# EAGLE board main_v2 (EAGLE 7.2.0)
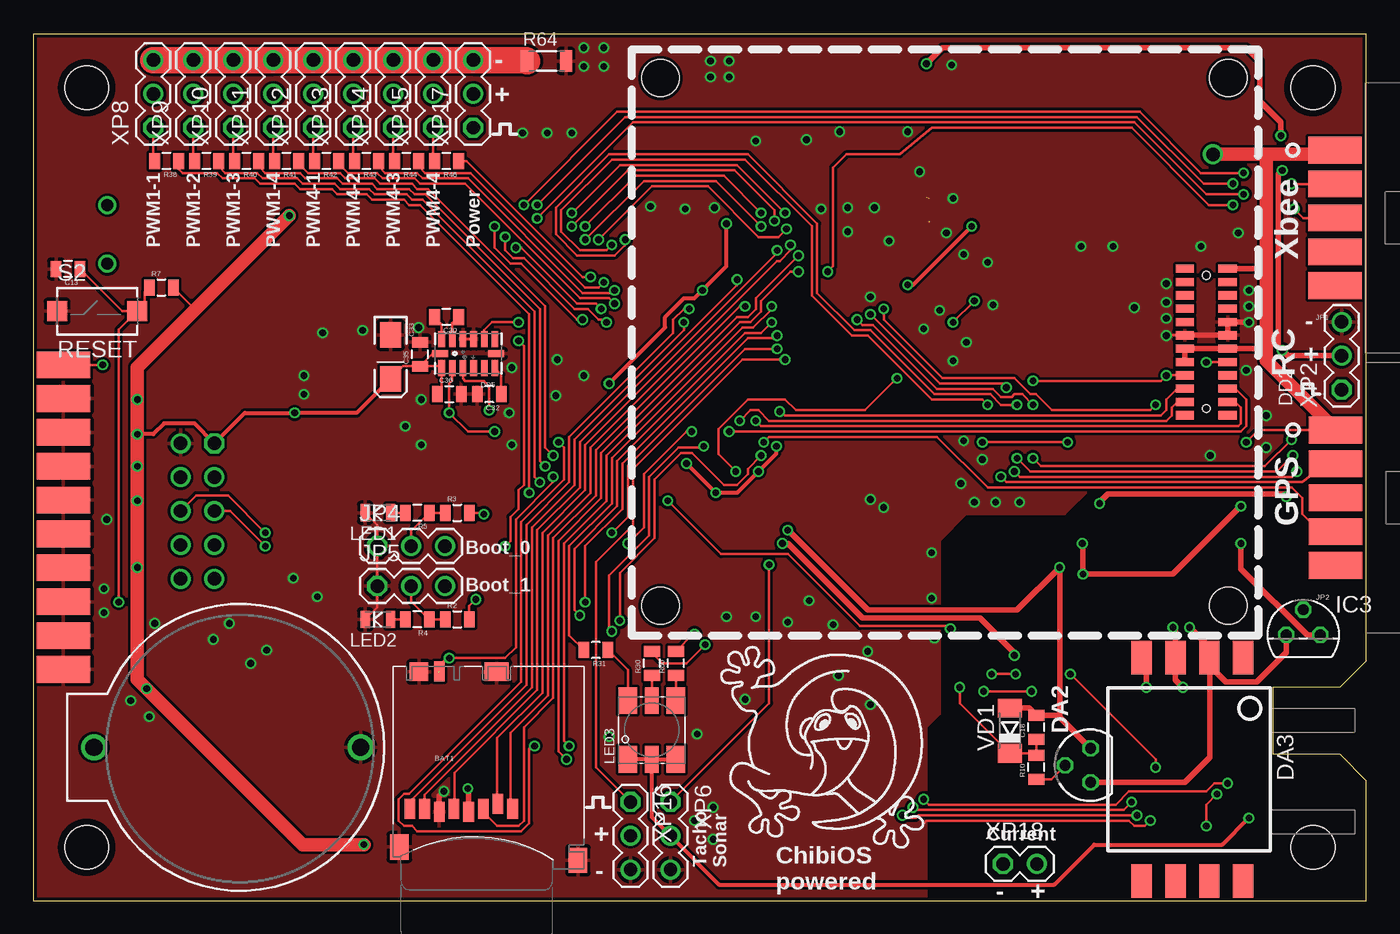
[diagram p3: board, top side]
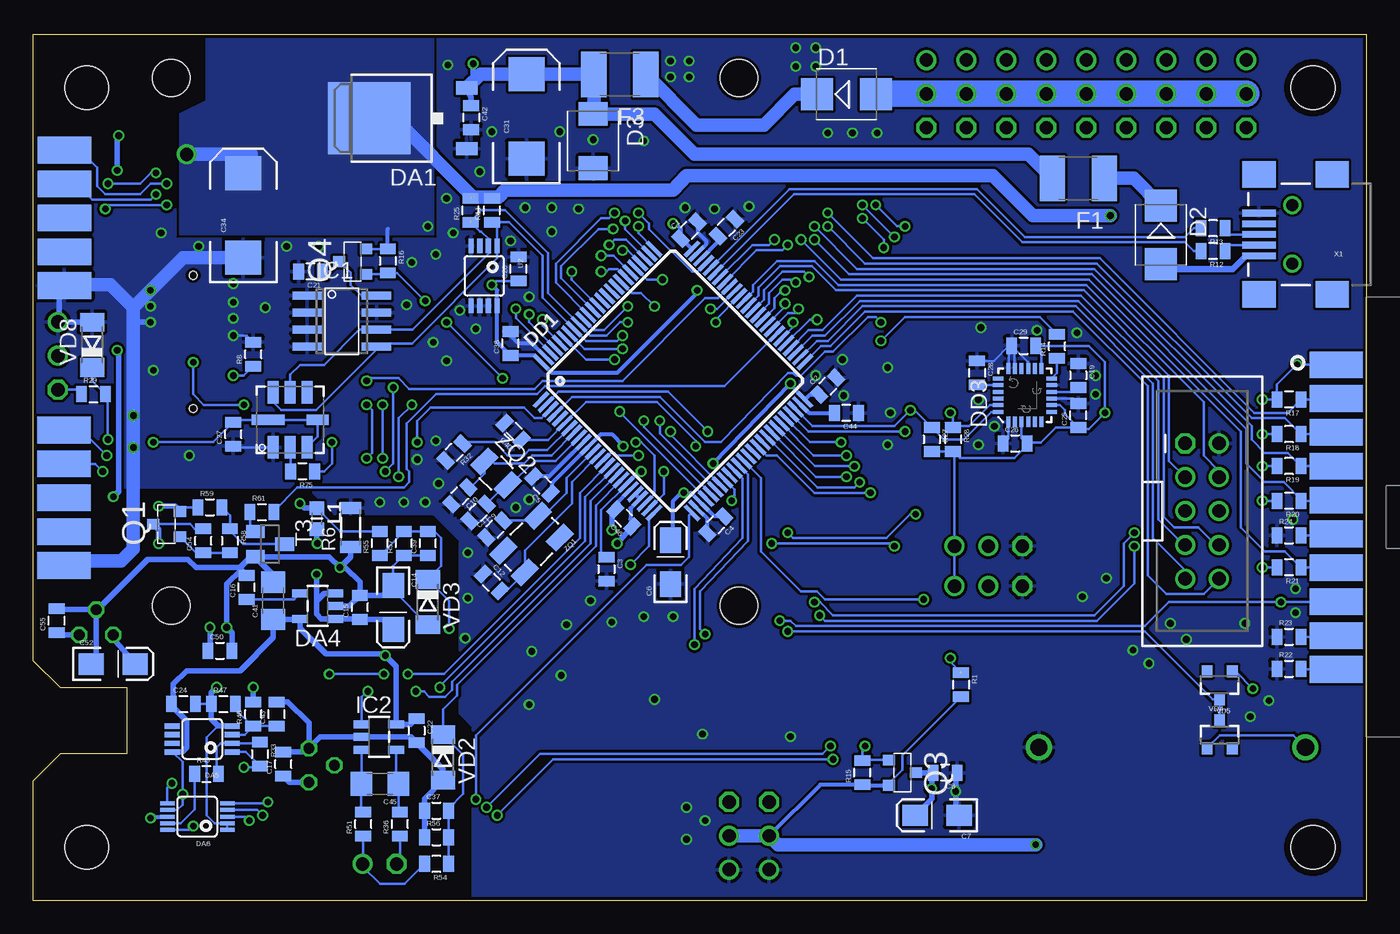
[diagram p4: board, bottom side, seen from below]

Size 100 x 65 mm. Coordinates in mm from the lower left corner, seen from the top.
Outline: 0,0 100,0 100,9 98,11 93,11 93,16 98,16 100,18 100,65 0,65 0,0
Copper layers (1*16): Top 0.035mm / dielectric 1.1mm / Bottom 0.035mm
Design rules "SeeedStudio_DRU_no_angle_20130527": minimum track width 6mil, minimum drill 12mil, track to track 6mil, track to pad 6mil, pad to pad 6mil, via to via 6mil, smd to smd 0mil, copper to edge 10mil, drill to drill 10mil, minimum pad ring 6mil, minimum via ring 6mil, stop-mask expansion 2mil, vias tented up to drill 25mil, thermal gap 10mil
Net classes: 1 +5V_A: width 0.4 mm, drill 0.5 mm; 2 +3.3V_A: width 0.4 mm, drill 0.5 mm; 3 GND_A: width 0.4 mm, drill 0.5 mm
tRestrict: 4 lines
bRestrict: 4 lines

## Footprints (pad centres in the part's own frame; a part is rotated, then mirrored left to right if it is on the bottom)
BATTCOM_20MM_PTH = drill 1.3: 1 20,0; 2 0,0
0805 = smd 0.8 x 1.2: 1 -0.9,0; 2 0.9,0
EIA3216-KIT = smd 1.9 x 1.6: A 1.65,0; C -1.65,0
EIA7343 = smd 2.55 x 2.7: A 3.17,0; C -3.17,0
1206 = smd 1.6 x 1.8: 1 -1.4,0; 2 1.4,0
SMB = smd 2.4 x 2.4: A 2.2,0; C -2.2,0
SMBJ = smd 1.78 x 2.16: A 2.04,0; C -2.03,0
TO252 = smd 1 x 1.6: 1 -2.28,-4.8; 2 2.28,-4.8 | smd 5.4 x 6.2: 3 0,2.5
TO92 = drill 0.813 octagon: 1 -1.27,0; 2 0,1.905; 3 1.27,0
482 = smd 2.54 x 1.524: 1 -7.62,3.81; 2 -7.62,1.27; 3 -7.62,-1.27; 4 -7.62,-3.81; 5 9.144,-3.81; 6 9.144,-1.27; 7 9.144,1.27; 8 9.144,3.81
SOT23-5 = smd 0.6 x 1.2: 1 -0.95,-1.306; 2 0,-1.306; 3 0.95,-1.306; 4 0.95,1.306; 5 -0.95,1.306
MSOP8 = smd 0.4 x 1.1: 1 -0.975,-2.25; 2 -0.325,-2.25; 3 0.325,-2.25; 4 0.975,-2.25; 5 0.975,2.25; 6 0.325,2.25; 7 -0.325,2.25; 8 -0.975,2.25
MSOP10 = smd 0.3 x 1.1: 1 -1,-2.25; 2 -0.5,-2.25; 3 0,-2.25; 4 0.5,-2.25; 5 1,-2.25; 6 1,2.25; 7 0.5,2.25; 8 0,2.25; 9 -0.5,2.25; 10 -1,2.25
TQFP100 = smd 1.5 x 0.3: 1 -8,6; 2 -8,5.5; 3 -8,5; 4 -8,4.5; 5 -8,4; 6 -8,3.5; 7 -8,3; 8 -8,2.5; 9 -8,2; 10 -8,1.5; 11 -8,1; 12 -8,0.5; 13 -8,0; 14 -8,-0.5; 15 -8,-1; 16 -8,-1.5; 17 -8,-2; 18 -8,-2.5; 19 -8,-3; 20 -8,-3.5; 21 -8,-4; 22 -8,-4.5; 23 -8,-5; 24 -8,-5.5; 25 -8,-6; 51 8,-6; 52 8,-5.5; 53 8,-5; 54 8,-4.5; 55 8,-4; 56 8,-3.5; 57 8,-3; 58 8,-2.5; 59 8,-2; 60 8,-1.5; 61 8,-1; 62 8,-0.5; 63 8,0; 64 8,0.5; 65 8,1; 66 8,1.5; 67 8,2; 68 8,2.5; 69 8,3; 70 8,3.5; 71 8,4; 72 8,4.5; 73 8,5; 74 8,5.5; 75 8,6 | smd 0.3 x 1.5: 26 -6,-8; 27 -5.5,-8; 28 -5,-8; 29 -4.5,-8; 30 -4,-8; 31 -3.5,-8; 32 -3,-8; 33 -2.5,-8; 34 -2,-8; 35 -1.5,-8; 36 -1,-8; 37 -0.5,-8; 38 0,-8; 39 0.5,-8; 40 1,-8; 41 1.5,-8; 42 2,-8; 43 2.5,-8; 44 3,-8; 45 3.5,-8; 46 4,-8; 47 4.5,-8; 48 5,-8; 49 5.5,-8; 50 6,-8; 76 6,8; 77 5.5,8; 78 5,8; 79 4.5,8; 80 4,8; 81 3.5,8; 82 3,8; 83 2.5,8; 84 2,8; 85 1.5,8; 86 1,8; 87 0.5,8; 88 0,8; 89 -0.5,8; 90 -1,8; 91 -1.5,8; 92 -2,8; 93 -2.5,8; 94 -3,8; 95 -3.5,8; 96 -4,8; 97 -4.5,8; 98 -5,8; 99 -5.5,8; 100 -6,8
ADIS16480 = smd 0.61 x 1.37: 1 25.3,0.05; 2 25.3,3.25; 3 24.3,0.05; 4 24.3,3.25; 5 23.3,0.05; 6 23.3,3.25; 7 22.3,0.05; 8 22.3,3.25; 9 21.3,0.05; 10 21.3,3.25; 11 20.3,0.05; 12 20.3,3.25; 13 19.3,0.05; 14 19.3,3.25; 15 18.3,0.05; 16 18.3,3.25; 17 17.3,0.05; 18 17.3,3.25; 19 16.3,0.05; 20 16.3,3.25; 21 15.3,0.05; 22 15.3,3.25; 23 14.3,0.05; 24 14.3,3.25 | hole 2.8: 0,0; 0,42.6; 39.6,42.6; 39.6,0 | hole 0.6: 14.8,1.642; 24.8,1.642
QFN-24-NP = smd 0.8 x 0.3: 1 -2,1.25; 2 -2,0.75; 3 -2,0.25; 4 -2,-0.25; 5 -2,-0.75; 6 -2,-1.25; 13 2,-1.25; 14 2,-0.75; 15 2,-0.25; 16 2,0.25; 17 2,0.75; 18 2,1.25 | smd 0.3 x 0.8: 7 -1.25,-2; 8 -0.75,-2; 9 -0.25,-2; 10 0.25,-2; 11 0.75,-2; 12 1.25,-2; 19 1.25,2; 20 0.75,2; 21 0.25,2; 22 -0.25,2; 23 -0.75,2; 24 -1.25,2
MICROSD = smd 0.8 x 1.5: 1 -1.94,2.7; 2 -0.84,2.3; 3 0.26,2.7; 4 1.36,2.9; 5 2.46,2.7; 6 3.56,2.9; 7 4.66,2.7; 8 5.76,2.7; 13 3.56,-7.641 | smd 1.4 x 1.9: 9 6.55,5.55; 10 -6.85,6.55 | smd 1.8 x 1.4: 11 -0.75,-7.6 | smd 1.4 x 1.4: 12 5.077,-7.6
LGA14 = smd 0.5 x 1.2: 1 2,1.1; 2 1.2,1.1; 3 0.4,1.1; 4 -0.4,1.1; 5 -1.2,1.1; 6 -2,1.1; 8 -2,-1.1; 9 -1.2,-1.1; 10 -0.4,-1.1; 11 0.4,-1.1; 12 1.2,-1.1; 13 2,-1.1 | smd 1.2 x 0.5: 7 -2.1,0; 14 2.1,0
1812 = smd 1.9 x 3.4: 1 -1.95,0; 2 1.95,0
SO-08 = smd 0.6 x 2.2: 1 -1.905,-2.6; 2 -0.635,-2.6; 3 0.635,-2.6; 4 1.905,-2.6; 5 1.905,2.6; 6 0.635,2.6; 7 -0.635,2.6; 8 -1.905,2.6
PLD_2X05_PSEUDOSMD = smd 4 x 2: 1 0,5.08; 3 0,2.54; 5 0,0; 7 0,-2.54; 9 0,-5.08 | smd 4 x 2 bottom: 2 0,5.08; 4 0,2.54; 6 0,0; 8 0,-2.54; 10 0,-5.08
STAND-OFF = hole 3.3: 0,0
PLD_1X03 = drill 1 octagon: 1 0,0 | drill 1: 2 2.54,0; 3 5.08,0
2X5-SHROUDED = drill 1 octagon: 1 -1.27,5.08 | drill 1: 2 1.27,5.08; 3 -1.27,2.54; 4 1.27,2.54; 5 -1.27,0; 6 1.27,0; 7 -1.27,-2.54; 8 1.27,-2.54; 9 -1.27,-5.08; 10 1.27,-5.08
L0603 = smd 1 x 1.1: 1 -0.794,0; 2 0.794,0
LED-0805 = smd 0.7 x 1.3: A -1,0; C 0.9,0
LED-TRICOLOR-5050 = smd 2 x 1.4: 1 -2.2,1.8; 3 -2.2,-1.8; 4 2.2,-1.8; 6 2.2,1.8 | smd 2 x 1: 2 -2.2,0; 5 2.2,0
MICRO3 = smd 0.8 x 0.9: 1 -0.95,-1; 2 0.95,-1; 3 0,1
1206' = smd 0.9 x 1.6: 1 -1.45,0; 2 1.45,0
BUTTON_6X3.5 = smd 1.5 x 1.5: P 0,-1.75; S 6,-1.75
SOT23 = smd 1 x 1.4: 1 -0.95,-1.1; 2 0.95,-1.1; 3 0,1.1
BMP085 = smd 1.67 x 0.8: 1 -2.065,1.27; 2 -2.065,0; 3 -2.065,-1.27; 5 2.065,-1.27; 6 2.065,0; 7 2.065,1.27 | smd 0.8 x 1.67: 4 0,-2.065 | smd 0.8 x 2.5: 8 0,1.65
SOD80C = smd 1.4 x 1.8: A 1.7,0; C -1.7,0
SOT23-3 = smd 0.8 x 0.9: 1 -0.95,-1; 2 0.95,-1; 3 0,1.1
USB-MINIB-NOSTOP = smd 2.5 x 0.5: D+ 2.5,0; D- 2.5,0.8; GND 2.5,-1.6; ID 2.5,-0.8; VBUS 2.5,1.6 | smd 2.5 x 2: G1 -3,-4.5; G2 -3,4.5; G3 2.5,4.5; G4 2.5,-4.5 | drill 0.9 pad 0.8: H1 0,2.2 | drill 0.9 pad 0.787: H2 0,-2.2
PLD_2X10_PSEUDOSMD = smd 4 x 2: 1 0,11.43; 3 0,8.89; 5 0,6.35; 7 0,3.81; 9 0,1.27; 11 0,-1.27; 13 0,-3.81; 15 0,-6.35; 17 0,-8.89; 19 0,-11.43 | smd 4 x 2 bottom: 2 0,11.43; 4 0,8.89; 6 0,6.35; 8 0,3.81; 10 0,1.27; 12 0,-1.27; 14 0,-3.81; 16 0,-6.35; 18 0,-8.89; 20 0,-11.43
PLD_1X02 = drill 1 octagon: 1 0,0 | drill 1: 2 2.54,0
CRYSTAL-SMD-5X3 = smd 1.9 x 1.1: 1 -1.85,-1.15; 2 1.85,-1.15; 3 1.85,1.15; 4 -1.85,1.15
CRYSTAL-32KHZ-SMD-3.2X1.5 = smd 1.1 x 1.9: 1 -1.3,0.05; 2 1.2,0.05

## Placement (x,y rotation side)
BAT1  3V  [BATTCOM_20MM_PTH]  24.56,11.5 180 top
C1  0.1uF  [0805]  50.8,50.3 45 bottom
C2  0.1uF  [0805]  40.4,38.6 45 bottom
C3  0.1uF  [0805]  57,24.88 270 bottom
C4  0.1uF  [0805]  48.8,28.2 225 bottom
C5  0.1uF  [0805]  61.83,31.18 135 bottom
C6  10uF/6.3v  [EIA3216-KIT]  52.2,25.4 90 bottom
C7  47uF/6.3v  [EIA3216-KIT]  32.2,6.4 180 bottom
C8  0.1uF  [0805]  31.6,9.6 180 bottom
C9  10pF  [0805]  66.62,29.12 225 bottom
C10  10pF  [0805]  68,30.38 225 bottom
C11  20pF  [0805]  65.38,27.88 45 bottom
C12  20pF  [0805]  65.62,23.88 315 bottom
C13  0.1uF  [0805]  2.6,47.4 180 top
C14  10uF/16v  [EIA3216-KIT]  73,22 270 bottom
C15  0.1uF  [0805]  75.5,22 90 bottom
C16  0.01uF  [0805]  84,23.5 90 bottom
C17  0.1uF  [0805]  81.25,10.25 90 bottom
C18  0.1uF  [0805]  75.25,13 90 top
C19  0.1uF  [0805]  21.6,39.4 270 bottom
C20  0.1uF  [0805]  63.6,47.4 90 bottom
C21  0.1uF  [0805]  79.2,47.2 180 bottom
C22  0.1uF  [0805]  71.25,12.75 270 bottom
C23  2.2uF  [0805]  48,50.5 225 bottom
C24  0.1uF  [0805]  88.75,14.75 0 bottom
C25  0.1uF  [0805]  21.6,36.4 90 bottom
C26  0.1uF  [0805]  26.35,34.3 0 bottom
C27  0.1uF  [0805]  85,35 90 bottom
C28  2.2nF/50v  [0805]  29.2,39.6 270 bottom
C29  0.1uF  [0805]  25.7,41.63 0 bottom
C30  0.22uF  [0805]  31,43.8 180 top
C31  330uF/10v  [EIA7343]  63.01,58.85 90 bottom
C32  4.7uF  [0805]  34.2,38 180 top
C33  10uF  [EIA3216-KIT]  26.8,40.8 270 top
C34  470uF/6.3v  [EIA7343]  84.24,51.41 90 bottom
C35  0.1uF  [0805]  29,41 90 top
C36  0.1uF  [0805]  31.2,38 0 top
C37  0.1uF  [0805]  69.75,6.75 0 bottom
C38  0.1uF  [0805]  64.2,41.8 90 bottom
C39  0.1uF  [0805]  70.4,26.8 90 bottom
C40  0.1uF  [0805]  64,35.2 135 bottom
C41  10uF  [1206]  82,22.5 90 bottom
C42  0.1uF  [0805]  67.15,58.75 270 bottom
C43  2.2uF  [0805]  81.75,14 90 bottom
C44  2.2uF  [0805]  39,36.6 180 bottom
C45  10uF  [1206]  74,8.75 180 bottom
C46  0.1uF  [0805]  55.7,28.7 135 bottom
C50  0.1uF  [0805]  86,18.75 0 bottom
C52  10uF/6.3v  [EIA3216-KIT]  94,17.75 0 bottom
C54  0.1uF  [0805]  87.25,27 90 bottom
C55  0.1uF  [0805]  98.25,21 90 bottom
D1  10BQ060  [SMB]  39,60.5 0 bottom
D2  10BQ060  [SMB]  15.4,49.95 270 bottom
D3  SM6T12V  [SMBJ]  58,57 270 bottom
DA1  LM1117-3.3  [TO252]  72.28,58.71 90 bottom
DA2  AD22100  [TO92]  79.32,10.15 90 top
DA3  MPXV5010DP  [482]  86.96,10.61 270 top
DA4  LP2985  [SOT23-5]  78.68,22.1 90 bottom
DA5  MAX44246  [MSOP8]  87.33,12.13 90 bottom
DA6  AD5200  [MSOP10]  87.7,6.3 90 bottom
DD1  STM32F407VGT6  [TQFP100]  52,39 45 bottom
DD2  ADIS16480  [ADIS16480]  89.65,22.12 90 top
DD3  MPU9150  [QFN-24-NP]  25.61,37.93 90 bottom
DD4  MICROSD_SDIO  [MICROSD]  34.01,9.57 180 top
DD5  LSM303DLHC  [LGA14]  32.63,41.05 180 top
F1  POLYSWITCH  [1812]  21.6,54.2 180 bottom
F3  POLYSWITCH  [1812]  56,62 180 bottom
IC1  24AA32ASN  [SO-08]  76.86,43.48 270 bottom
IC2  INA194  [SOT23-5]  74.07,12.27 270 bottom
IC3  LP2950Z  [TO92]  95.28,19.93 0 top
JP1  2X5  [PLD_2X05_PSEUDOSMD]  97.67,51.23 0 top
JP2  2X5  [PLD_2X05_PSEUDOSMD]  97.7,30.23 0 top
JP3  STAND-OFF  [STAND-OFF]  4,61 0 top
JP4  boot_0  [PLD_1X03]  25.8,26.6 0 top
JP5  boot_1  [PLD_1X03]  25.8,23.6 0 top
JP6  M05X2SHD  [2X5-SHROUDED]  12.31,29.23 0 bottom
JP7  STAND-OFF  [STAND-OFF]  96,61 0 top
JP8  STAND-OFF  [STAND-OFF]  4,4 0 top
JP9  STAND-OFF  [STAND-OFF]  96,4 0 top
L1  1uH  [L0603]  78.73,28.66 270 bottom
LED1  RED  [LED-0805]  25.8,29.1 180 top
LED2  RED  [LED-0805]  25.8,21.1 180 top
LED3  LED-TRICOLOR-5050  [LED-TRICOLOR-5050]  46.4,12.8 90 top
Q1  IRLML5203  [MICRO3]  90,28.25 90 bottom
Q3  IRLML5203  [MICRO3]  34.8,9.6 270 bottom
Q4  IRLML5203  [MICRO3]  76.04,47.95 90 bottom
R1  10k  [0805]  30.4,16.2 270 bottom
R2  10k  [0805]  31.8,21.1 0 top
R3  10k  [0805]  31.8,29.1 0 top
R4  100  [0805]  28.8,21.1 180 top
R5  100  [0805]  28.8,29.1 180 top
R6  0  [1206']  76.2,28 90 bottom
R7  10k  [0805]  9.6,46 0 top
R8  10k  [0805]  83.5,41 90 bottom
R10  10k  [0805]  75.25,10 90 top
R11  2.7k  [0805]  65.6,51.8 90 bottom
R12  33  [0805]  11.5,48.75 180 bottom
R13  33  [0805]  11.5,50.45 180 bottom
R14  1k  [0805]  23.2,41.6 90 bottom
R15  10k  [0805]  37.8,9.6 90 bottom
R16  10k  [0805]  73.4,48 270 bottom
R17  10k  [0805]  5.8,37.6 180 bottom
R18  10k  [0805]  5.8,35 180 bottom
R19  10k  [0805]  5.8,32.6 180 bottom
R20  10k  [0805]  5.8,30 180 bottom
R21  10k  [0805]  5.8,25 180 bottom
R22  10k  [0805]  5.8,17.4 0 bottom
R23  10k  [0805]  5.8,19.8 0 bottom
R24  10k  [0805]  5.8,27.4 0 bottom
R25  2.7k  [0805]  67.2,51.8 90 bottom
R27  2.7k  [0805]  32.6,34.6 270 bottom
R28  2.7k  [0805]  31,34.6 270 bottom
R29  1k  [0805]  95.5,38 0 bottom
R30  68  [0805]  46.4,17.8 90 top
R31  0  [0805]  42.2,18.8 180 top
R32  100k  [0805]  68.43,33.65 225 bottom
R33  100k  [0805]  83,11 270 bottom
R36  47  [0805]  72.5,5.75 90 bottom
R38  330  [0805]  10,55.5 180 top
R39  330  [0805]  13,55.5 180 top
R40  330  [0805]  16,55.5 180 top
R41  330  [0805]  19,55.5 180 top
R42  330  [0805]  22,55.5 180 top
R43  330  [0805]  25,55.5 180 top
R44  330  [0805]  28,55.5 180 top
R45  10k  [0805]  87,9.5 0 bottom
R46  330  [0805]  31,55.5 180 top
R47  100k  [0805]  85.75,14.75 0 bottom
R48  10k  [0805]  83.5,14 90 bottom
R51  47  [0805]  75.25,5.75 90 bottom
R54  10k  [0805]  69.75,2.75 180 bottom
R55  10k  [0805]  74,26.8 90 bottom
R56  1k  [0805]  69.75,4.75 0 bottom
R57  1k  [0805]  72.2,26.8 90 bottom
R58  1k  [0805]  85.25,27 270 bottom
R59  10k  [0805]  86.75,29.5 0 bottom
R60  0  [0805]  48.2,17.8 90 top
R61  1k  [0805]  82.85,29.15 0 bottom
R64  0  [1206']  38.5,63 0 top
R75  1k  [0805]  79.8,32.2 180 bottom
S2  RESET  [BUTTON_6X3.5]  1.79,45.98 0 top
T3  BC848  [SOT23]  82.25,26.75 270 bottom
U2  TMP75DGK  [MSOP8]  66.18,46.87 180 bottom
U44  BMP085  [BMP085]  80.73,36.08 90 bottom
U$2  [LOGO_CHIBIOS_SILK]  60.5,11.6 0 top
VD1  BZV55-C3V3  [SOD80C]  73.25,12.75 90 top
VD2  BZV55-C3V3  [SOD80C]  69.25,10.75 270 bottom
VD3  BZV55-C3V3  [SOD80C]  70.4,22.4 270 bottom
VD4  BAR43  [SOT23-3]  11,12.41 0 bottom
VD5  BAR43  [SOT23-3]  11,16.2 180 bottom
VD8  BZV55-C3V3  [SOD80C]  95.6,41.7 90 bottom
X1  USB-SMD-NS  [USB-MINIB-NOSTOP]  5.55,49.99 180 bottom
XP1  2X10-PSEUDO_SMD  [PLD_2X10_PSEUDOSMD]  2.25,28.78 0 bottom
XP2  RECEIVER  [PLD_1X03]  98.16,38.34 90 top
XP6  sonar  [PLD_1X03]  47.8,7.4 270 top
XP8  PWM1  [PLD_1X03]  9,58 90 top
XP9  PWM2  [PLD_1X03]  12,58 90 top
XP10  PWM3  [PLD_1X03]  15,58 90 top
XP11  PWM4  [PLD_1X03]  18,58 90 top
XP12  PWM5  [PLD_1X03]  21,58 90 top
XP13  PWM6  [PLD_1X03]  24,58 90 top
XP14  PWM7  [PLD_1X03]  27,58 90 top
XP15  PWM8  [PLD_1X03]  30,58 90 top
XP16  tacho  [PLD_1X03]  44.8,7.4 270 top
XP17  power  [PLD_1X03]  33,58 90 top
XP18  current_sens  [PLD_1X02]  72.75,2.75 0 top
ZQ1  8M  [CRYSTAL-SMD-5X3]  62.62,26.75 225 bottom
ZQ2  32k  [CRYSTAL-32KHZ-SMD-3.2X1.5]  65.28,32 315 bottom

## Tracks (layer width: path | path; a pad name or v marks a point on that pad's centre or on a via)
3.3V  (via drill 0.5, 1)  (1 unrouted)
  Top 0.2: v5.2,40.2 1.85,40.2 XP1.2 | R7.2 12,44.5 12.3,44.5 | C35.1 30.48,40.1 DD5.1 30.63,38.33 C36.1 | DD5.14 29.95,41.05 C35.1 | C33.A 27.75,40.1 C35.1 | v91,34.4 91.91,35.31 JP2.1
  Top 0.3: v43.2,38.8 47.4,43 47.4,43.8 48.8,45.2 49.6,45.2 v50.2,45.8 52,47.6 v52,50.8 | v49,32.8 v51.2,30.6 52.8,30.6 v54.4,32.2 55.75,33.55 v55.75,34.1 | v65.6,46.2 66,46.2 v70.4,50.6 | v91.2,6.2 89.2,4.2 79.6,4.2 76.6,1.2 51.46,1.2 XP6.2 46.4,6.26 LED3.2 | v7.8,35 9,35 9.8,35.8 12.09,35.8 JP6.1 15.87,36.6 v19.6,36.6 24.25,36.6 C33.A | LED3.2 LED3.1 | LED3.2 LED3.3
  Top 0.4: 92.5,41.4 92.48,41.42 DD2.13 DD2.14 DD2.16 | DD2.1 92.48,47.42 92.5,47.4
  Top 1: JP2.1 92.5,40.51 92.5,41.4 92.5,47.4 92.5,55.9 arc90 92.4,56 | v88.5,56 92.4,56 | 92.4,56 97.76,56 arc90 JP1.1 | v19.2,51.4 12.3,44.5 7.8,40 v7.8,37.6 v7.8,35 v7.8,32.6 v7.8,30 v7.8,25 7.8,16.6 v8.5,15.9 20.2,4.2 v24.8,4.2
  Bottom 0.2: DD1.19 55.54,31.16 57.4,29.3 57.4,26.18 C3.1 56.8,26 | C1.1 51.35,49.66 | DD1.11 | XP1.2 v5.2,40.21 | v5.2,40.21 v5.2,40.2 | v5.2,40.21 6.7,38.71 R17.2 v7.8,37.6 | R18.2 v7.8,35 | R19.2 v7.8,32.6 | R20.2 v7.8,30 | R21.2 v7.8,25 | DD3.8 22.98,37.18 22.6,36.8 22.6,36.5 C25.1 | C25.1 23.3,35.5 24.41,34.39 25.45,34.39 C26.2 25.86,34.71 DD3.3 | R16.1 Q4.2 | U44.3 78.67,34.81 U44.4 U44.8 84.82,36.08 C27.2 86.5,34.4 v91,34.4 | R11.2 65.7,52.8 65.1,52.8 | C20.1 65.3,46.5 v65.6,46.2 | C25.1 21.5,35.4 20.8,35.4 v19.6,36.6 19.6,40.4 20.8,41.6 24.57,41.6 C29.2 24.36,41.19 DD3.13 | VD5.1 9.8,17.2 v8.5,15.9 | R27.2 R28.2 | R28.2 30.5,33.2 26.4,33.2 25.45,34.15 | JP5.3 JP4.3 30.88,33.58 arc-90 R28.2 | R1.2 34.8,10.9 34.8,9.8 35.8,8.8 Q3.2
  Bottom 0.3: C5.1 61.06,31.35 DD1.11 57.41,35 56.6,35 55.75,34.15 v55.75,34.1 | 51.35,49.66 DD1.75 | v49,32.8 v43.2,38.8 42.72,38.2 DD1.50 41.72,37.96 C2.1 | C1.1 51.44,50.44 51.8,50.8 v52,50.8 | Q3.2 37.75,8.65 R15.1 40.96,8.7 XP16.2 | DD1.19 54.56,32.2 v54.4,32.2 | C6.A 52,27.25 52,30 51.4,30.6 v51.2,30.6 50.67,30.6 DD1.28 48.91,28.84 C4.1 | v65.6,46.2 65.2,45.8 U2.8 65.2,41.91 C38.1 62.38,40.9 DD1.100 61.09,39.6 56.2,39.6 50.2,45.6 v50.2,45.8 | R16.1 73.4,50.4 | v91.2,6.2 91.1,6.3 DA6.8 | 25.45,34.15 C26.2
  Bottom 0.5: 72.91,58.71 DA1.3
  Bottom 1: v88.5,56 83.66,56 C34.A | 72.91,58.71 67,52.8 65.1,52.8 64.6,53.3 52,53.3 51,54.4 28,54.4 25,51.4 v19.2,51.4 | v24.8,4.2 44.14,4.2 XP16.2 XP6.2
  pour Bottom (no thermals): 70,65 70,50 89,50 89,59 87,60 87,65
5V_ENABLE
  Bottom 0.2: DD1.57 48.16,38.6 61.6,38.6 62.2,38 69.8,38 72,35.8 72,32.4 71.8,32.2 71.8,31.4 72.2,31 80.2,31 81.95,29.25 R61.2
5V_USB
  Bottom 0.5: X1.VBUS 9.01,48.39 10,47.4 15.85,47.4 D2.A
6V  (via drill 0.5)
  Top 0.4: v93.7,54.8 93.4,54.5 93.4,41.6 v93.7,41.3 94.12,40.88 XP2.2 | v94,30.3 93.8,30.5 80.6,30.5 80,29.9 v80,29.8 | v93.6,57.4 93.6,58.4 92,60 92,63 91,64 68.2,64 v67,62.8
  Bottom 0.2: L1.1 76.98,27.7 R55.2
  Bottom 0.4: v93.7,41.3 93.6,41.2 93.6,30.7 v94,30.3 | 78.73,29.63 L1.1 79.65,29.45 v80,29.8 | v93.7,54.8 93.7,57.3 v93.6,57.4 | v67,62.8 67,61.47 DA1.2 67.15,60.26 C42.1
  Bottom 1: DA1.2 66.45,62.02 C31.A 62.99,62 F3.2 57.95,59.08 D3.C 57.97,59 53.4,59 50.4,56 25.35,56 F1.2
!AD_CS  (via drill 0.5)
  Top 0.2: v57.4,48.4 54.2,45.2 54.2,44.4 53.6,43.8 52.8,43.8 42.6,33.6 42.6,30.2 39.4,27 39.4,11.2 v40,10.6 | v65.2,6.4 65.4,6.2 66.2,6.2 66.4,6.4 v82.8,6.4
  Bottom 0.2: DD1.81 56.45,48.4 v57.4,48.4 | v82.8,6.4 83.2,6.8 DA6.4 | v40,10.6 61,10.6 v65.2,6.4
+3.3V_A  (via drill 0.5)
  Top 0.2: v88.8,8 88,7.2 v88,5.6
  Top 0.4: v73.6,18.4 73.6,18.6 71,21.2 62.2,21.2 56.6,26.8 v56.2,26.8
  Bottom 0.2: DA6.10 88.3,5.3 v88,5.6 | DA6.7 89.2,6.8 88.8,7.2 v88.8,8 88.8,10.4 89.53,11.13 89.6,11.13 DA5.8
  Bottom 0.254: DD1.21 54.83,30.47
  Bottom 0.3: C46.1 55.06,28.46 55.2,28.6 55.2,29.44 DD1.22 54.52,30.16 54.83,30.47
  Bottom 0.4: DA5.8 88.84,11.15 88.5,11.5 88.5,13.5 89.65,14.65 C24.1 89.5,14.9 89.5,16.25 88.5,17.25 84.5,17.25 82,19.75 C41.1 80.04,21.1 DA4.5 79.99,20.44 78.04,18.5 73.7,18.5 v73.6,18.4 | C22.1 71.68,13.22 IC2.5 72.76,17.56 73.5,18.3 | v73.6,18.4 73.5,18.3 | v73.6,18.4 73.6,18.3 73.5,18.3 | v56.2,26.8 56,27.03 C46.1
+5V_A  (via drill 0.5)
  Top 0.4: 88.23,18.57 DA3.2 88.25,18.21 88.25,17.6 | v86.75,20.5 88.4,18.85 88.4,18.4 88.23,18.57 | IC3.1 94.01,18.61 91.8,16.4 89.45,16.4 88.25,17.6 | 88.23,18.98 88.23,18.57 | 88.25,17.6 88.25,10.75 86.38,8.88 DA2.1
  Bottom 0.4: C52.A 94.01,19.66 IC3.1 | v86.75,20.5 86.75,18.9 C50.1 | C17.1 80.78,8.88 DA2.1
AD_CLK  (via drill 0.5)
  Top 0.2: v89.6,8.8 88.6,8.8 88,8.2 82.2,8.2 81.2,7.2 67.2,7.2 v66.8,7.6
  Bottom 0.2: DD1.26 50.8,28.89 50.8,25.8 51.4,25.2 54,25.2 66.8,12.4 v66.8,7.6 | DA6.6 89.95,8.45 v89.6,8.8
AD_SDI  (via drill 0.5)
  Top 0.2: v57.4,47.2 56.8,47.2 54.6,45 54.6,44.2 53.8,43.4 53,43.4 43,33.4 43,30 39.8,26.8 39.8,12 v40.2,11.6 | v66,7 66.2,6.8 81.8,6.8 v82.4,7.4
  Bottom 0.2: DD1.82 56.16,47.4 56.8,47.4 57,47.2 v57.4,47.2 | v82.4,7.4 82.5,7.3 DA6.5 | v40.2,11.6 40.8,11 62,11 v66,7
ADIS_INT  (via drill 0.5)
  Top 0.2: DD2.15 89.58,40.4 v88,40.4 | v84.2,37.2 83.8,36.8 76.4,36.8 75.2,38 74.8,38 73.6,39.2 68.2,39.2 63.8,43.6 v63.8,44.4
  Bottom 0.2: v88,40.4 88,38 87.2,37.2 v84.2,37.2 | DD1.98 63.8,43.73 v63.8,44.4
ADIS_MISO  (via drill 0.5)
  Top 0.2: v53,36 53.8,36.8 54.4,36.8 55.2,36 85,36 85.4,36.4 85.4,37 85.82,37.42 DD2.22
  Bottom 0.2: v53,36 53,35.05 DD1.31
ADIS_MOSI  (via drill 0.5)
  Top 0.2: DD2.19 90.18,38.42 91,37.6 91,35.6 90.6,35.2 v52.2,35.2
  Bottom 0.2: v52.2,35.2 52.2,34.96 DD1.32
ADIS_NRST  (via drill 0.5)
  Top 0.2: DD2.18 85.02,39.42 v85,39.4 84.6,39 v75,39
  Bottom 0.2: v85,39.4 84.2,39.4 R8.1 | DD1.67 48.63,45.2 49.6,45.2 55.8,39 61.8,39 62.4,38.4 71.8,38.4 72.6,39.2 74.8,39.2 v75,39
ADIS_NSS  (via drill 0.5)
  Top 0.2: v56,36.7 56.4,36.4 84.6,36.4 85,36.8 85,37.6 85.82,38.42 DD2.20
  Bottom 0.2: v56,36.7 56,36.64 DD1.29
ADIS_SCK  (via drill 0.5)
  Top 0.2: DD2.21 90.18,37.42 90.6,37 90.6,35.8 90.4,35.6 54.6,35.6 v54.2,36
  Bottom 0.2: DD1.30 54.2,35.54 v54.2,36
BMP085_EOC  (via drill 0.5)
  Top 0.2: v71.2,34.4 v77.6,34.4
  Bottom 0.2: DD1.3 61.87,36.2 62.4,36.2 63.2,37 70.2,37 71.2,36 v71.2,34.4 | v77.6,34.4 77.6,32.8 78.2,32.2 R75.1
BOOT_0  (via drill 0.5)
  Top 0.2: v55.8,41.4 53.4,41.4 44.6,32.6 44.6,28.8 v43.4,27.6 | v33.8,29 33.7,29.1 R3.2
  Bottom 0.2: DD1.94 58.64,41.4 v55.8,41.4 | v43.4,27.6 43,27.2 36,27.2 34.2,29 v33.8,29
BOOT_1  (via drill 0.5)
  Top 0.2: v33.2,22.6 32.7,22.1 R2.2
  Bottom 0.2: DD1.37 45.4,31.69 45.4,26.2 42.4,23.2 41.2,23.2 40.6,22.6 v33.2,22.6
CURRENT_SENS  (via drill 0.5)
  Top 0.2: v71.3,15.7 v74.9,15.7
  Bottom 0.2: v71.3,15.7 70.7,15.7 70.3,15.3 69.1,15.3 68.6,15.8 68.6,16.4 58.2,26.8 58.2,29.97 DD1.17 | v74.9,15.7 75.38,15.28 IC2.1
EEPROM_PWR_EN  (via drill 0.5)
  Top 0.2: v52.7,32.2 51.4,33.5 51.4,35.4 53.6,37.6 56.4,37.6 57.2,36.8 62.4,36.8 v64.8,39.2 | v69,43.4 v70.6,45
  Bottom 0.2: Q4.1 73.5,47 R16.2 72.7,47.1 v70.6,45 | DD1.24 52.7,30.52 v52.7,32.2 | v64.8,39.2 v69,43.4
FROM_GPS  (via drill 0.5)
  Top 0.2: v94.5,33.4 93.3,32.2 74.8,32.2 v73.8,33.2 | v73.8,37.2 72.6,37.2 71.8,38 67.6,38 62.8,42.8 61.6,42.8 58.8,45.6 58.8,50.8 53.6,56 43.2,56 39.2,52 39.2,50 40.8,48.4 43.6,48.4 44.4,49.2 v44.4,49.6
  Bottom 0.2: JP2.2 96.41,35.31 v94.5,33.4 | v73.8,33.2 v73.8,37.2 | DD1.69 46.04,49.2 44.8,49.2 v44.4,49.6
FROM_XBEE  (via drill 0.5)
  Top 0.2: v43,43.4 42.8,43.6 42.4,43.6 41.6,44.4 40.6,44.4 36.8,48.2 36,48.2 35.4,48.8 v35.4,49.8 | v37.8,52.2 44.4,58.8 82.8,58.8 87.8,53.8 v90,53.8
  Bottom 0.2: JP1.2 96.51,56.31 95.2,55 95.2,53.6 94.6,53 92,53 91.2,53.8 v90,53.8 | v43,43.4 43,43.05 DD1.56 | v37.8,52.2 v35.4,49.8
GND  (via drill 0.5)
  Top 0.2: DD2.12 85.02,42.42 v85,42.4 | LED1.C 25.8,28.2 JP4.1 JP5.1 25.8,22 LED2.C | DD5.10 DD5.11 | v83.8,6 83.4,5.6 82.6,5.6 82.2,6 67,6 66.8,5.8
  Top 0.4: v91.2,43.4 91.18,43.42 DD2.9 DD2.11 DD2.12 | v30.8,8.2 30.45,7.85 DD4.6
  Bottom 0.2: v85,42.4 84,42.4 R8.2 | DD3.1 26.86,34.69 C26.1 | C25.2 21.98,37.68 DD3.9 | 23.22,38.68 DD3.11 | DD3.18 26.8,39.99 26.8,41.43 C29.1 | DD3.17 26.4,39.97 26.4,41.43 C29.1 | DD3.15 25.4,39.97 25.4,40.4 26.6,41.6 C29.1 | C28.1 27.93,40.5 26.8,41.63 C29.1 | C27.1 84.92,34.02 U44.1 | DA6.3 84.1,6.3 v83.8,6
  Bottom 0.3: DD1.10 61.31,31.81 C5.2 | DD1.74 49.5,49.28 49.5,49.5 50.16,50.16 C1.2 | DD1.99 62.58,41.8 63.6,41.8 64.2,42.4 C38.2 | C4.2 49.44,28.66 DD1.27
  Bottom 0.4: v91.2,43.4 92.5,43.4 | C8.1 30.8,9.5 v30.8,8.2 30.8,6.65 C7.C | VD8.A 95.62,43.42 XP2.3 98.07,43.51 98.07,45.75 JP1.10
  Bottom 1: JP1.10 97.72,46.5 97.72,46.22 94.22,46.22 92.5,44.5 | 92.5,44.5 92.5,43.4 92.5,26.4 93.4,25.5 97.75,25.5 JP2.10 | C34.C 88.76,48.24 92.5,44.5
  other vias: 51,7 39.2,37.9 39.3,40.6 41.3,39.4 46.3,52.1 48.9,51.9 51.1,52 54.2,57 58,57.1 65.6,57.7 60.5,57.7 59.1,51.9 66.5,54.7 61.1,50.2 69,52.7 68.5,50.1 64.2,49.5 62.8,45.3 69.8,48.5 41.3,64 42.8,64 42.8,62.6 41.3,62.6 91,39.8 92.5,36.4 88.3,33.4 69,40.5 70,41.9 66.8,42.9 71.6,47.9 72,44.7 82.6,44.5 71.2,33.1 69.8,34.5 74,29.9 70.6,29.9 67.4,26.1 67.4,22.7 62.8,30.1 63.8,29.5 92.5,34 91.2,44.6 91.2,45.8 85,43.7 85,44.9 85,46.3 58.2,22.5 60,20.7 62.6,18.7 52,21.3 54.2,21.3 53.4,15.1 49.8,12.5 43.2,12.3 49.6,6 51,4.6 62.8,14.7 60.4,16.9 56.6,20.9 5.3,21.6 5.5,28.6 5.3,23.4 14.7,20.8 19.5,24.2 21.3,22.8 17.5,18.8 29.1,34.2 27.9,35.6 20.3,39.4 20.3,38 29.1,37.6 28.9,43 24.7,42.8 21.7,42.6 35.7,36.6 35.9,40 35.9,34.2 16.3,17.8 13.5,19.6 8.7,13.8 7.3,15 9.1,20.8 36.7,57.6 40.4,57.6 72.2,29.9 69.6,31.3 67.6,19.7 68,44.3 63.1,52 61.1,52 68.9,62.7 50.8,63 52.2,63 52.2,61.8 50.8,61.8 38.55,57.6 81,49.1 87.6,49.1 78.6,49.1 90.4,50.1
  pour Bottom (isolate 0.2, rank 3): 0,0 0,65 100,65 100,31 79.4,31 77.4,29 70,29 68,27 68,14 67,13 67,0
  pour Top (isolate 0.2, rank 3): 0,0 0,65 100,65 100,31 79.4,31 77.4,29 70,29 68,27 68,14 67,13 67,0
GND_A  (via drill 0.5)
  Top 0.4: v85.5,20.5 arc-90 85.69,20.31 DA3.3 85.69,16.56 v86.25,16 | DA2.3 77,13.74 | 77,13.74 76.84,13.9 C18.2 74.7,14.45 VD1.A | 77,13.74 v77,25 73.8,21.8 62.6,21.8 v56.6,27.8
  Bottom 0.2: C24.2 R47.1 | DD1.20 55.13,30.87 | C39.1 R57.1 73,25.1 C14.C 73,23.3 VD3.A | 86.12,13.12 87,12.25 87,6.4 86.4,5.8 DA6.2 DA6.1
  Bottom 0.3: C46.2 56.34,29.71 DD1.20
  Bottom 0.4: DA2.3 79.59,11.15 C17.2 | IC3.2 98.19,21.84 C55.2 | IC3.2 95.28,18.12 C52.C | T3.2 83.7,25.8 84.5,25 | 84.5,25 87.8,25 88.4,25.6 91.4,25.6 95.17,21.84 IC3.2 | C14.C 73.75,22.9 C15.2 | C15.2 76.3,22.1 DA4.2 | C16.2 84.42,24.82 | 84.42,24.82 84.5,24.9 84.5,25 | C41.2 82,24.45 T3.2 | 84.42,24.82 85.5,23.75 v85.5,20.5 85.1,20.1 C50.2 | DA5.4 85.1,13.12 86.12,13.12 86.65,13.65 R47.1 86.65,15.6 v86.25,16 | C43.2 80.9,14.9 79.32,13.32 DA2.3 | R56.1 C37.1 70.65,7.65 VD2.A 69.25,9.85 C22.2 71.67,12.27 IC2.2 78.47,12.27 DA2.3 | C15.2 75.5,23.9 76.6,25 v77,25 | R6.1 76.2,25.8 v77,25 | T3.2 77.8,25.8 v77,25 | v56.6,27.8 56.6,28.97 C46.2
GPS_ENABLE  (via drill 0.5)
  Top 0.2: v94.8,32.2 94.4,31.8 74,31.8 v73.6,32.2 | v73,38.5 72.8,38.8 68,38.8 v62.8,44
  Bottom 0.2: v73.6,32.2 73,32.8 v73,38.5 | DD1.97 60.88,41.48 62.8,43.4 v62.8,44 | v94.8,32.2 95.37,32.77 JP2.4
GPS_PPS  (via drill 0.5)
  Top 0.2: JP2.7 96.51,27.69 95.2,29 95.2,30.2 94.4,31 71.6,31 67.8,34.8 55.2,34.8 v54.8,34.4
  Bottom 0.2: DD1.23 53.4,30.53 53.4,33.4 54.4,34.4 v54.8,34.4
I2C_FAST_SCL  (via drill 0.5)
  Top 0.2: DD5.2 31.43,39.03 31.2,38.8 v31.2,36.6 32.6,35.2 v34.6,35.2
  Bottom 0.2: DD3.23 28.22,37.18 29.8,35.6 30.9,35.6 R28.1 31,36.4 v31.2,36.6 | DD1.47 41.84,35.2 v34.6,35.2
I2C_FAST_SDA  (via drill 0.5)
  Top 0.2: DD5.3 32.23,39.17 32.4,39 33.8,39 34.2,38.6 v34.2,36.8
  Bottom 0.2: DD1.48 41.53,35.6 35.4,35.6 v34.2,36.8 33.9,36.8 R27.1 31.7,34.6 30.2,34.6 28.12,36.68 DD3.24
I2C_SLOW_SCL  (via drill 0.5)  (1 unrouted)
  Top 0.2: v55.4,43.4 54.6,42.6 53.4,42.6 43.8,33 43.8,29.6 40.6,26.4 40.6,21.8 v41,21.4 | v17.4,26.6 14.77,29.23 JP6.5
  Bottom 0.2: IC1.6 74.22,42.8 | U44.6 80.73,39.47 80,40.2 78.2,40.2 75.56,42.84 IC1.6 | 67.2,51 66.4,51.8 64.6,51.8 61.4,48.6 61.4,45.57 DD1.92 58.23,42.4 57,42.4 56,43.4 v55.4,43.4 | R25.1 66.5,50.2 66.4,50.2 65.86,49.66 U2.2 65.8,49.06 65.8,48.6 71.56,42.84 IC1.6 | v17.4,26.6 17.4,23.8 20.2,21 40.6,21 v41,21.4
I2C_SLOW_SDA  (via drill 0.5)
  Top 0.2: v55.8,42.4 55.6,42.2 53.6,42.2 44.2,32.8 44.2,29.4 41.4,26.6 v41.4,22.4 | v17.4,27.6 14.6,30.4 12.2,30.4 JP6.6
  Bottom 0.2: U44.7 82,37.4 81.4,36.8 78.8,36.8 74.26,41.34 IC1.5 74.03,41.8 71.6,41.8 65.2,48.2 U2.1 65.2,50.51 arc-90 R11.1 | 65.6,50.8 R11.1 | R11.1 64.3,50.9 61.8,48.4 61.8,45.26 DD1.93 58.54,42 56.2,42 v55.8,42.4 | v17.4,27.6 18.2,26.8 18.2,23.6 20.4,21.4 40,21.4 41,22.4 v41.4,22.4
LED_B  (via drill 0.5)
  Top 0.2: v55.4,44.6 55.4,44.4 54,43 53.2,43 43.4,33.2 43.4,29.8 40.2,26.6 40.2,19.9 R31.2
  Bottom 0.2: DD1.91 57.92,42.8 57.2,42.8 v55.4,44.6
LED_G  (via drill 0.5)
  Top 0.2: R60.2 49.5,20 v49.6,20
  Bottom 0.2: DD1.36 46.4,31.99 46.4,27 50,23.2 50,20.4 v49.6,20
LED_R  (via drill 0.5)
  Top 0.2: v50.4,19.2 49,17.8 47.2,17.8 46.4,18.6 R30.2
  Bottom 0.2: DD1.35 46.8,31.68 46.8,27.2 50.4,23.4 v50.4,19.2
MAG_INT  (via drill 0.5)
  Top 0.2: v36.4,43.4 34.4,43.4 33.83,42.83 DD5.9
  Bottom 0.2: DD1.4 59.56,37.8 53,37.8 49.6,34.4 48.4,34.4 43.4,39.6 43,39.6 42.8,39.4 42.4,39.4 40.6,41.2 40,41.2 37.4,43.8 36.8,43.8 v36.4,43.4
MAIN_SUPPLY
  Bottom 0.2: R54.2 72.15,1.25 74,1.25 75.29,2.54 XP18.2 75.25,2.79 R51.1
MPU9150_INT  (via drill 0.5)
  Top 0.2: v49.4,35.2 49,35.2 45.8,32 45.8,28 v44.6,26.8 | v35.4,26.6 35.8,27 35.8,28.8 36.4,29.4 36.4,30.8 36.8,31.2 36.8,41.6 v36.4,42
  Bottom 0.2: DD1.2 60.58,38.2 52.4,38.2 v49.4,35.2 | R14.2 24.5,43.8 34.6,43.8 v36.4,42 | v35.4,26.6 35.6,26.8 v44.6,26.8
MPXV_TEMP  (via drill 0.5)
  Top 0.2: C18.1 R10.2 75.1,11.05 VD1.C 69.5,14.8 v69.5,16
  Bottom 0.2: DD1.16 58.6,30.28 58.6,27 69.5,16.1 v69.5,16
N$1
  Bottom 0.2: DD1.9 60.83,33 62.4,33 64.21,31.19 ZQ2.2 64.56,31.19 C9.1
N$2
  Top 0.2: LED2.A R4.2
N$3
  Top 0.2: JP5.2 28.34,22.46 R4.1 R2.1
N$4
  Top 0.2: LED1.A R5.2
N$5
  Top 0.2: JP4.2 28.34,27.74 R5.1 R3.1
N$6
  Bottom 0.2: DD1.8 61.14,33.4 62.6,33.4 63.2,32.8 65.4,32.8 65.56,32.95 ZQ2.1 66.16,32.05 67.2,31.01 C10.1
N$7
  Bottom 0.2: DD1.13 59.6,31.4 59.6,29.8 63.12,26.28 ZQ1.3 64.51,23.24 C12.2
N$8
  Top 0.2: R31.1 44.6,17.3 LED3.6
N$9
  Bottom 0.2: DD1.12 60,31.71 60,30.6 61.73,28.87 ZQ1.1 62.49,28.51 C11.2
N$10
  Bottom 0.2: R12.1 10.16,49.19 X1.D-
N$11
  Bottom 0.2: DA6.9 88.95,5.8 87.9,6.85 R45.1
N$12
  Top 0.2: LED3.5 R30.1
N$13
  Bottom 0.2: R13.1 10.14,49.99 X1.D+
N$14
  Bottom 1: D1.C 42.9,60.5 45.2,58.2 50.25,58.2 F3.1
N$15
  Bottom 0.2: C16.1 80.44,22.6 DA4.4
N$16
  Top 0.2: R10.1 76.36,9.1 DA2.2
N$17
  Bottom 0.2: XP1.19 5.1,17.35 R22.2
N$18
  Bottom 0.2: R23.2 1.85,19.8 XP1.17
N$19
  Bottom 0.2: R24.2 1.85,27.4 XP1.11
N$20
  Bottom 0.2: IC2.4 72.76,8.91 C45.1 72.6,6.75 R36.2
N$21
  Bottom 0.2: C28.2 27.63,38.7 DD3.20
N$22
  Bottom 0.2: DD3.10 21.92,38.18 C19.2
N$23  (via drill 0.5)
  Top 0.4: v32.6,8.4 32.65,8.35 DD4.4
  Bottom 0.4: C7.A 32.6,7.65 v32.6,8.4 32.6,9.5 C8.2 Q3.3
N$24
  Top 0.2: C30.1 31.43,43.33 DD5.12
N$25
  Bottom 0.2: C21.1 77.79,47.2 Q4.3 76.2,47.11 76.2,46.2 75.39,45.38 IC1.8
N$26
  Bottom 0.2: R14.1 23.2,39.59 DD3.12
N$27
  Top 0.2: C30.2 30.63,43.27 DD5.13
N$28
  Top 0.2: C32.1 35.1,39.48 DD5.6
N$29
  Bottom 0.2: VD4.1 11.95,11.45 11,12.4 5.46,12.4 BAT1.1
N$30  (via drill 0.5)
  Top 0.4: v90.6,29.6 85.5,24.5 v78.75,24.5 78.75,26.75 v78.7,26.8
  Bottom 0.2: Q1.2 88.7,29.5 R59.1
  Bottom 0.4: C14.A 73.75,21.1 C15.1 75.55,21.15 DA4.1 78.4,21.15 78.75,21.5 78.75,22.5 | 78.75,22.5 78.2,23.05 DA4.3 | v90.6,29.6 89.4,29.6 Q1.2 | L1.2 78.73,26.83 v78.7,26.8 | 78.75,22.5 v78.75,24.5
N$31
  Top 0.2: LED3.4 R60.1
N$32
  Bottom 0.2: R29.1 96.74,38.34 XP2.1
N$33  (via drill 0.5)
  Top 0.2: v50.3,34.1 50.2,34 48.4,34 46.2,31.8 46.2,27.4 43.2,24.4 43.2,20.4 v43.4,20.2
  Bottom 0.2: C40.1 61.39,34.56 DD1.6 58.55,37.4 53.2,37.4 50.3,34.5 v50.3,34.1 | v43.4,20.2 16.6,20.2 11.5,15.1 VD5.3 VD4.3
N$34
  Bottom 0.2: DD1.7 61.44,33.8 62.8,33.8 63.2,33.4 64.4,33.4 65.4,34.4 67.79,34.4 R32.1
N$35  (via drill 0.5)
  Top 0.4: v83.5,16 83.5,17.88 DA3.4
  Bottom 0.4: R48.2 v83.5,16
N$36
  Bottom 1: F1.1 17.45,54.2 D2.C
N$37
  Bottom 0.2: IC2.3 75.38,8.77 C45.2 75.4,6.8 R51.2
N$39
  Bottom 0.2: R36.1 72.5,3 XP18.1
N$46
  Bottom 0.2: R33.1 83.09,11.8 DA5.2 85.94,11.8 86.25,11.5 86.25,9.65 R45.2
N$47
  Bottom 0.2: R48.1 83.6,13.1 84.75,14.25 84.75,14.65 R47.2 | DA5.3 84.14,12.46 R48.1 | R48.1 C43.1
N$52
  Bottom 0.2: R54.1 R56.2 C37.2 68.85,6.9 67.75,8 67.75,10.95 VD2.C 69.25,14.35 68.2,15.4 68.2,16.2 57.8,26.6 57.8,29.66 DD1.18
N$53
  Bottom 0.2: Q1.1 87.8,26.1 C54.1 R58.2
N$54  (via drill 0.5)
  Top 0.2: v68.8,20.4 68.6,20.6 62,20.6 56.6,26 51.6,26 v47.6,30
  Bottom 0.2: R55.1 R57.2 C39.2 69.9,27.7 69.4,27.2 69.4,25.1 VD3.C 68.8,22.5 v68.8,20.4 | v47.6,30 47.4,30.2 47.4,30.86 DD1.33
N$55  (via drill 0.5)
  Top 0.4: IC3.3 95.57,19.93 90.6,24.9 v90.6,26.8
  Bottom 0.2: Q1.3 88.25,28.25 87.9,27.9 C54.2
  Bottom 0.4: IC3.3 98.08,19.93 C55.1 | Q1.3 90.6,27.85 v90.6,26.8
N$59
  Bottom 0.2: T3.1 83.75,28.1 R61.1
N$74
  Bottom 0.2: R75.2 80.7,33.98 U44.2
N$78
  Top 2: XP8.3 XP9.3 XP10.3 XP11.3 XP12.3 XP13.3 XP14.3 XP15.3 XP17.3 36.97,63.08 R64.1
N$81
  Bottom 0.2: 48.64,49.44 C23.2
  Bottom 0.3: DD1.73 48.64,49.44
N$82
  Bottom 0.2: 42.43,37.23 DD1.49
  Bottom 0.3: 42.43,37.23 41.8,36.6 C44.2
NET$1
  Bottom 0.2: R59.2 85.25,28.9 R58.1 85.25,27.75 84.25,26.75 T3.3
PRESS_DIFF  (via drill 0.5)
  Top 0.2: v73.7,17 v71.9,17 | v84.2,10 84.2,10.6 v77.8,17
  Bottom 0.2: DA5.1 84.06,11.15 R33.2 83.1,10 v84.2,10 | v71.9,17 69.2,17 59,27.2 59,30.59 DD1.15 | v77.8,17 v73.7,17
PWM1
  Top 0.2: R38.2 9,55.6 XP8.1
PWM2
  Top 0.2: R39.2 12,55.6 XP9.1
PWM3
  Top 0.2: R40.2 15,55.6 XP10.1
PWM4
  Top 0.2: R41.2 18,55.6 XP11.1
PWM5
  Top 0.2: R42.2 21,55.5 XP12.1
PWM6
  Top 0.2: R43.2 24,55.5 XP13.1
PWM7
  Top 0.2: R44.2 27,55.5 XP14.1
PWM8
  Top 0.2: R46.2 30,55.5 XP15.1
RECEIVER_PPM  (via drill 0.5)
  Top 0.2: v94.4,34.6 92.4,32.6 75.6,32.6 v75,33.2 | v75,37.2 74.2,38 73.6,38 73.4,37.8 72.6,37.8 72,38.4 67.8,38.4 63,43.2 62.2,43.2 v61.8,43.6
  Bottom 0.2: v94.4,34.6 94.4,37.8 R29.2 95.6,39 VD8.C | v75,33.2 74.6,33.6 74.6,36.8 v75,37.2 | DD1.96 61.8,43.14 v61.8,43.6
RESET  (via drill 0.5)
  Top 0.2: 7.82,44.2 S2.S | S2.S 6.67,44.23 C13.1 | S2.S 8.37,44.23 8.37,45.67 R7.1 | v6.4,22.4 6.4,42.84 S2.S | v54.6,33.4 53.6,32.4 53.6,32 52.8,31.2 51.8,31.2 49.4,33.6 48.6,33.6 46.6,31.6 46.6,27.2 44,24.6 v44,21
  Bottom 0.2: DD1.14 56.69,33.6 56.4,33.6 56.2,33.4 v54.6,33.4 | XP1.15 1.88,22.4 v6.4,22.4 14.8,22.4 16.6,20.6 42.8,20.6 43.2,21 v44,21
SDC_PWR_EN  (via drill 0.5)
  Top 0.2: v37.6,11.6 37.4,11.6 37.2,11.4 37.2,5.8 36.6,5.2 28.8,5.2 28.4,5.6 27.8,5.6 27.4,6 27.4,7.6 27.8,8 28.2,8 36.6,16.4 36.6,28.4 39.8,31.6 39.8,34 v39.4,34.4
  Bottom 0.2: v37.6,11.6 37.8,11.4 R15.2 37.75,10.55 Q3.1 | DD1.46 41.74,34.4 v39.4,34.4
SDIO_CK  (via drill 0.5)
  Top 0.2: DD4.5 31.6,6.92 31.6,9.6 37.8,15.8 37.8,27.8 41,31 41,34.4 52.8,46.2 v52.8,46.6
  Bottom 0.2: DD1.80 53.94,46.6 v52.8,46.6
SDIO_CMD  (via drill 0.5)
  Top 0.2: DD4.3 34,6.62 34,6.4 34.8,5.6 36.4,5.6 36.8,6 36.8,13 39,15.2 39,27.2 42.2,30.4 42.2,33.8 53,44.6 v53.4,44.6
  Bottom 0.2: DD1.83 55.06,45.6 54.4,45.6 v53.4,44.6
SDIO_D0  (via drill 0.5)
  Top 0.2: DD4.7 29.35,7.95 37.4,16 37.4,28 40.6,31.2 40.6,34.6 48.8,42.8 v48.8,43.4
  Bottom 0.2: v48.8,43.4 48.8,43.61 DD1.65
SDIO_D1  (via drill 0.5)
  Top 0.2: DD4.8 28.4,7.02 28.4,7.6 37,16.2 37,28.2 40.2,31.4 40.2,34.8 48,42.6 48,43.6 48.8,44.4 v49.2,44.4
  Bottom 0.2: DD1.66 48.72,44.4 v49.2,44.4
SDIO_D2  (via drill 0.5)
  Top 0.2: DD4.1 35.8,7.02 35.8,12.6 38.6,15.4 38.6,27.4 41.8,30.6 41.8,34 55.8,48 56,48 56.8,48.8 v56.8,49.2
  Bottom 0.2: DD1.78 55.53,49.6 56.4,49.6 v56.8,49.2
SDIO_D3  (via drill 0.5)
  Top 0.2: DD4.2 34.8,7.32 34.8,12.2 38.2,15.6 38.2,27.6 41.4,30.8 41.4,34.2 55.8,48.6 v55.8,48.8
  Bottom 0.2: DD1.79 55.44,48.8 v55.8,48.8
SDIO_DETECT  (via drill 0.5)  (1 unrouted)
  Top 0.2: DD4.13 30.4,17.26 | 30.45,17.55 DD4.13 | DD4.13 30.45,17.65 31,18.2 35.4,18.2 36.2,19 36.2,28.6 39,31.4 v39,31.8
  Bottom 0.2: R1.1 31.2,17.9 v31.2,18.2 | DD1.43 41.26,31.8 v39,31.8
SONAR_PWM  (via drill 0.5)
  Top 0.2: XP6.1 55.2,14.8 v55.2,25.2
  Bottom 0.2: DD1.25 53.8,28.71 53.8,26.6 v55.2,25.2
SPI2_MISO_UEXT
  Bottom 0.2: JP6.7 13.69,26.69 15.6,28.6 15.6,39 21.6,45 38,45 40.6,42.4 41.53,42.4 DD1.53
SPI2_MOSI_UEXT
  Bottom 0.2: JP6.8 11.29,26.69 12.6,28 14.4,28 15.2,28.8 15.2,39.2 21.4,45.4 38.2,45.4 40.8,42.8 41.84,42.8 DD1.54
SPI2_NSS_UEXT
  Bottom 0.2: JP6.10 12.19,23 15,23 16.4,24.4 16.4,38.6 22,44.2 37.6,44.2 40.2,41.6 40.91,41.6 DD1.51
SPI2_SCK_UEXT
  Bottom 0.2: JP6.9 13.58,24.78 16,27.2 16,38.8 21.8,44.6 37.8,44.6 40.4,42 41.22,42 DD1.52
TACHOMETER  (via drill 0.5)
  Top 0.2: v56.4,40.6 53.2,40.6 45,32.4 45,28.2 42.2,25.4 42.2,10 XP16.1
  Bottom 0.2: DD1.95 58.55,40.6 v56.4,40.6
TCK  (via drill 0.5)
  Top 0.2: v54.6,50.6 51.2,54 45.8,54 v41.4,49.6
  Bottom 0.2: XP1.9 1.85,30 R20.1 4.8,30 6.2,31.4 7.6,31.4 9,32.8 9,35.4 20.6,47 38.8,47 v41.4,49.6 | DD1.76 54.6,50.09 v54.6,50.6
TDI  (via drill 0.5)
  Top 0.2: v40.4,50.6 44.6,54.8 52.6,54.8 55.6,51.8 v55.6,51
  Bottom 0.2: XP1.5 1.85,35 R18.1 6.1,36.2 8.6,36.2 20.2,47.8 37.6,47.8 v40.4,50.6 | DD1.77 55.6,50.38 v55.6,51
TDO  (via drill 0.5)
  Top 0.2: v42.4,49.6 46.4,53.6 50.6,53.6 54.4,49.8 55.9,49.8 v56.5,50.4
  Bottom 0.2: XP1.13 1.85,25 R21.1 6.1,26.2 7.6,26.2 9.4,28 9.4,35.2 20.8,46.6 39.4,46.6 v42.4,49.6 | v56.5,50.4 57.6,50.4 60.4,47.6 60.4,46.69 DD1.89
TIM1_CH1  (via drill 0.5)
  Top 0.2: R38.1 10.9,54.9 11.2,54.6 13.8,54.6 14.2,54.2 16.6,54.2 17,53.8 19.6,53.8 20,53.4 22.4,53.4 22.8,53 25,53 25.4,52.6 27.8,52.6 28.2,52.2 29,52.2 37.2,44 v37.2,30.6
  Bottom 0.2: DD1.40 44.99,33.4 44.2,33.4 41.4,30.6 v37.2,30.6
TIM1_CH2  (via drill 0.5)
  Top 0.2: v38,31.4 37.6,31.8 37.6,44.2 29.2,52.6 28.4,52.6 28,53 25.6,53 25.2,53.4 23,53.4 22.6,53.8 20.2,53.8 19.8,54.2 17.2,54.2 16.8,54.6 14.4,54.6 13.9,55.1 R39.1
  Bottom 0.2: v38,31.4 38.4,31 41.17,31 DD1.42
TIM1_CH3  (via drill 0.5)
  Top 0.2: 16.9,55.1 R40.1 17,55.4 17,55 17.4,54.6 20,54.6 20.4,54.2 22.8,54.2 23.2,53.8 25.4,53.8 25.8,53.4 28.2,53.4 28.6,53 29.4,53 38,44.4 38,33 v38.4,32.6
  Bottom 0.2: DD1.44 41.36,32.6 v38.4,32.6
TIM1_CH4  (via drill 0.5)
  Top 0.2: v39,33.4 38.4,34 38.4,44.6 29.6,53.4 28.8,53.4 28.4,53.8 26,53.8 25.6,54.2 23.4,54.2 23,54.6 20.6,54.6 19.9,55.3 R41.1
  Bottom 0.2: DD1.45 41.45,33.4 v39,33.4
TIM4_CH1  (via drill 0.5)
  Top 0.2: R42.1 22.9,55.3 23.6,54.6 25.8,54.6 26.2,54.2 28.6,54.2 29,53.8 32.4,53.8 41,45.2 43.2,45.2 v43.6,44.8
  Bottom 0.2: DD1.59 43.6,44.57 v43.6,44.8
TIM4_CH2  (via drill 0.5)
  Top 0.2: R43.1 25.9,55.1 26.4,54.6 28.8,54.6 29.2,54.2 32.6,54.2 41.2,45.6 43.4,45.6 v43.6,45.8
  Bottom 0.2: DD1.60 44.4,44.48 44.4,45.2 43.8,45.8 v43.6,45.8
TIM4_CH3  (via drill 0.5)
  Top 0.2: R44.1 28.9,55.1 29.4,54.6 32.8,54.6 41.4,46 42.4,46 v42.8,46.4
  Bottom 0.2: DD1.61 44.8,44.79 44.8,45.6 43.8,46.6 43,46.6 v42.8,46.4
TIM4_CH4  (via drill 0.5)
  Top 0.2: R46.1 32.5,55.5 41.2,46.8 v41.8,46.8
  Bottom 0.2: DD1.62 45.2,45.09 45.2,45.8 43.8,47.2 42.2,47.2 v41.8,46.8
TMS  (via drill 0.5)
  Top 0.2: v54.6,51.6 51.8,54.4 45.2,54.4 v41.4,50.6
  Bottom 0.2: XP1.7 1.85,32.6 R19.1 5.9,33.6 7.6,33.6 8.6,34.6 8.6,35.6 20.4,47.4 38.2,47.4 v41.4,50.6 | DD1.72 50.16,47.2 50.6,47.2 53.8,50.4 53.8,50.8 v54.6,51.6
TO_GPS  (via drill 0.5)
  Top 0.2: JP2.3 96.97,32.77 95.2,31.4 73,31.4 v72.6,31.8 | v71.6,37.2 71.2,37.6 67.4,37.6 62.6,42.4 61.4,42.4 58.4,45.4 58.4,50.6 53.4,55.6 43.4,55.6 39.6,51.8 39.6,50.2 41,48.8 43,48.8 v43.4,49.2
  Bottom 0.2: v72.6,31.8 72.6,36.2 v71.6,37.2 | 48.11,46.49 DD1.68 45.74,48.8 43.8,48.8 v43.4,49.2
TO_XBEE  (via drill 0.5)
  Top 0.2: v41.2,43.6 40.8,43.6 36.6,47.8 35.8,47.8 34.6,49 v34.6,50.6 | v36.8,52.2 43.8,59.2 83,59.2 87.6,54.6 v90.8,54.6 | JP1.3 94.43,53.77 v94.4,53.8
  Bottom 0.2: v41.2,43.6 41.74,43.6 DD1.55 | v94.4,53.8 92,53.8 91.2,54.6 v90.8,54.6 | v36.8,52.2 35.2,50.6 v34.6,50.6
TRST  (via drill 0.5)
  Top 0.2: v40.4,51.6 44,55.2 52.8,55.2 v56.4,51.6
  Bottom 0.2: XP1.3 1.85,37.6 R17.1 5.9,36.6 8.4,36.6 20,48.2 37,48.2 v40.4,51.6 | v56.4,51.6 56.8,51.2 57.4,51.2 60.8,47.8 60.8,46.39 DD1.90
USART6_RX_UEXT
  Bottom 0.2: DD1.64 46,45.71 46,46.2 44.2,48 41.4,48 39.6,46.2 21,46.2 12.2,37.4 12.2,33.4 11.04,32.24 JP6.4
USART6_TX_UEXT
  Bottom 0.2: DD1.63 45.6,45.4 45.6,46 44,47.6 41.6,47.6 39.8,45.8 21.2,45.8 14.8,39.4 14.8,32.99 JP6.3
USB_DM
  Bottom 0.2: R12.2 12.95,48.75 13.6,49.4 25.8,49.4 29.4,53 42.95,53 DD1.70
USB_DP
  Bottom 0.2: R13.2 12.95,50.45 13.6,49.8 25.6,49.8 29.2,53.4 43.26,53.4 DD1.71
V_IN
  Bottom 2: XP8.2 XP9.2 XP10.2 XP11.2 XP12.2 XP13.2 XP14.2 XP15.2 XP17.2 36.76,60.54 D1.A
XBEE_CTS  (via drill 0.5)
  Top 0.2: v37.8,51.2 45,58.4 82.6,58.4 88,53 v90.8,53 | v42.6,44.4 42.2,44.8 40.8,44.8 36.6,49 v36.2,49
  Bottom 0.2: JP1.4 96.77,53.77 | 96.77,53.77 96.77,53.37 96.57,53.37 | v90.8,53 91.2,52.6 95.6,52.6 96.77,53.77 | v37.8,51.2 36.2,49.6 v36.2,49 | DD1.58 43.36,44.1 42.9,44.1 v42.6,44.4
XBEE_RESET  (via drill 0.5)
  Top 0.2: v59.6,47.2 60,47.6 60,55 61,56 65,56 67.4,58 82.4,58 88.2,52.2 v90,52.2 | JP1.5 95.27,51.23 v94.6,51.9
  Bottom 0.2: v59.6,47.2 59.6,46.6 DD1.88 | v90,52.2 94.3,52.2 v94.6,51.9

## Text on the board
tPlace: - | + | PWM1-1 | PWM1-2 | PWM1-3 | PWM1-4 | PWM4-1 | PWM4-2 | PWM4-3 | PWM4-4 | Power | Xbee | - | + | RC | GPS | Boot_0 | Boot_1 | + | Current | - | Tacho | Sonar | ChibiOS / powered | - | +
tDocu: TODO: / correct ADIS pinout / increase space between JTAG and USB connectors / replace microsd socket with more convenient one / increase space between battery holder and microsd socket / change opamp for pressure sensor from uSOP package to SO8 / delete D1 as unneded / / size - 1.016, ratio 18%